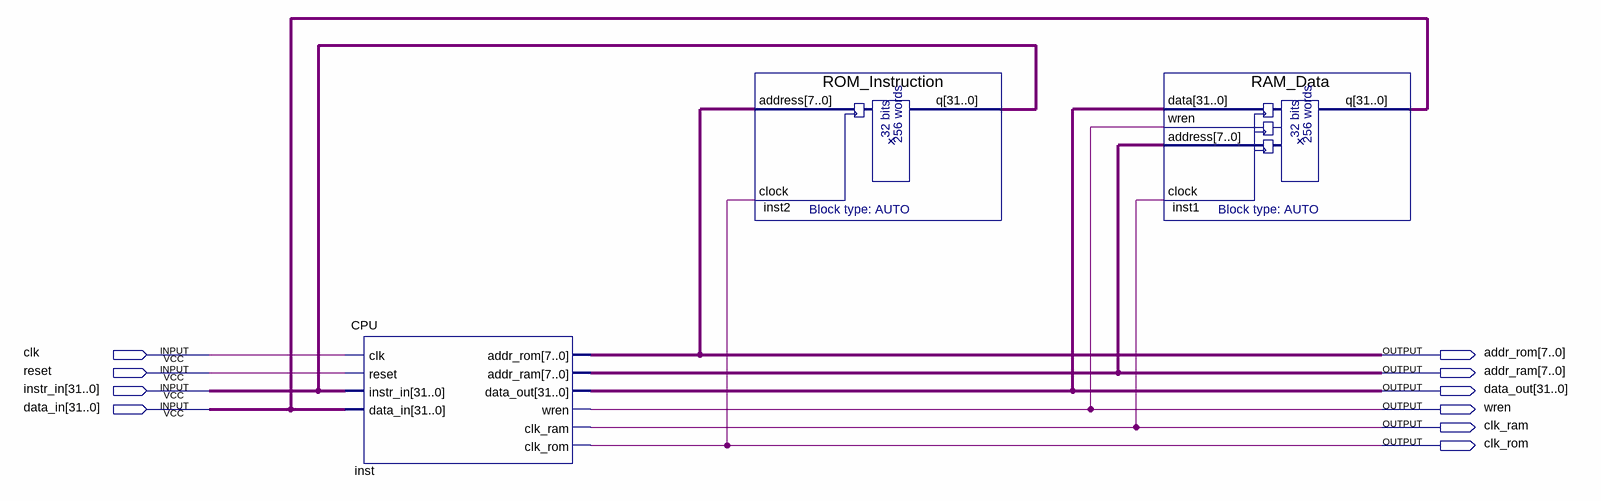
[diagram p0: schematic sheet]
// Quartus schematic Processador.bdf as structural Verilog: 3 symbols, 10 pins
module Processador (
  input  clk,
  input  reset,
  input  [31:0] instr_in,
  input  [31:0] data_in,
  output [7:0] addr_rom,
  output [7:0] addr_ram,
  output [31:0] data_out,
  output wren,
  output clk_ram,
  output clk_rom
);

  CPU inst (
    .clk(clk), .reset(reset), .instr_in(instr_in), .data_in(data_in), .addr_rom(addr_rom),
    .addr_ram(addr_ram), .data_out(data_out), .wren(wren), .clk_ram(clk_ram), .clk_rom(clk_rom));
  ROM_Instruction inst2 (.address(addr_rom), .clock(clk_rom), .q(instr_in));
  RAM_Data inst1 (.data(data_out), .wren(wren), .address(addr_ram), .clock(clk_ram), .q(data_in));
endmodule
